# EasyEDA schematic 1-Schematic_BLE_WAVER_DONGLE.json
TITLE: Sheet_1; REV: 1.0; Date: 2022-12-25; Sheet: 1/1; Drawn By: maarnotto; Company: Your Company
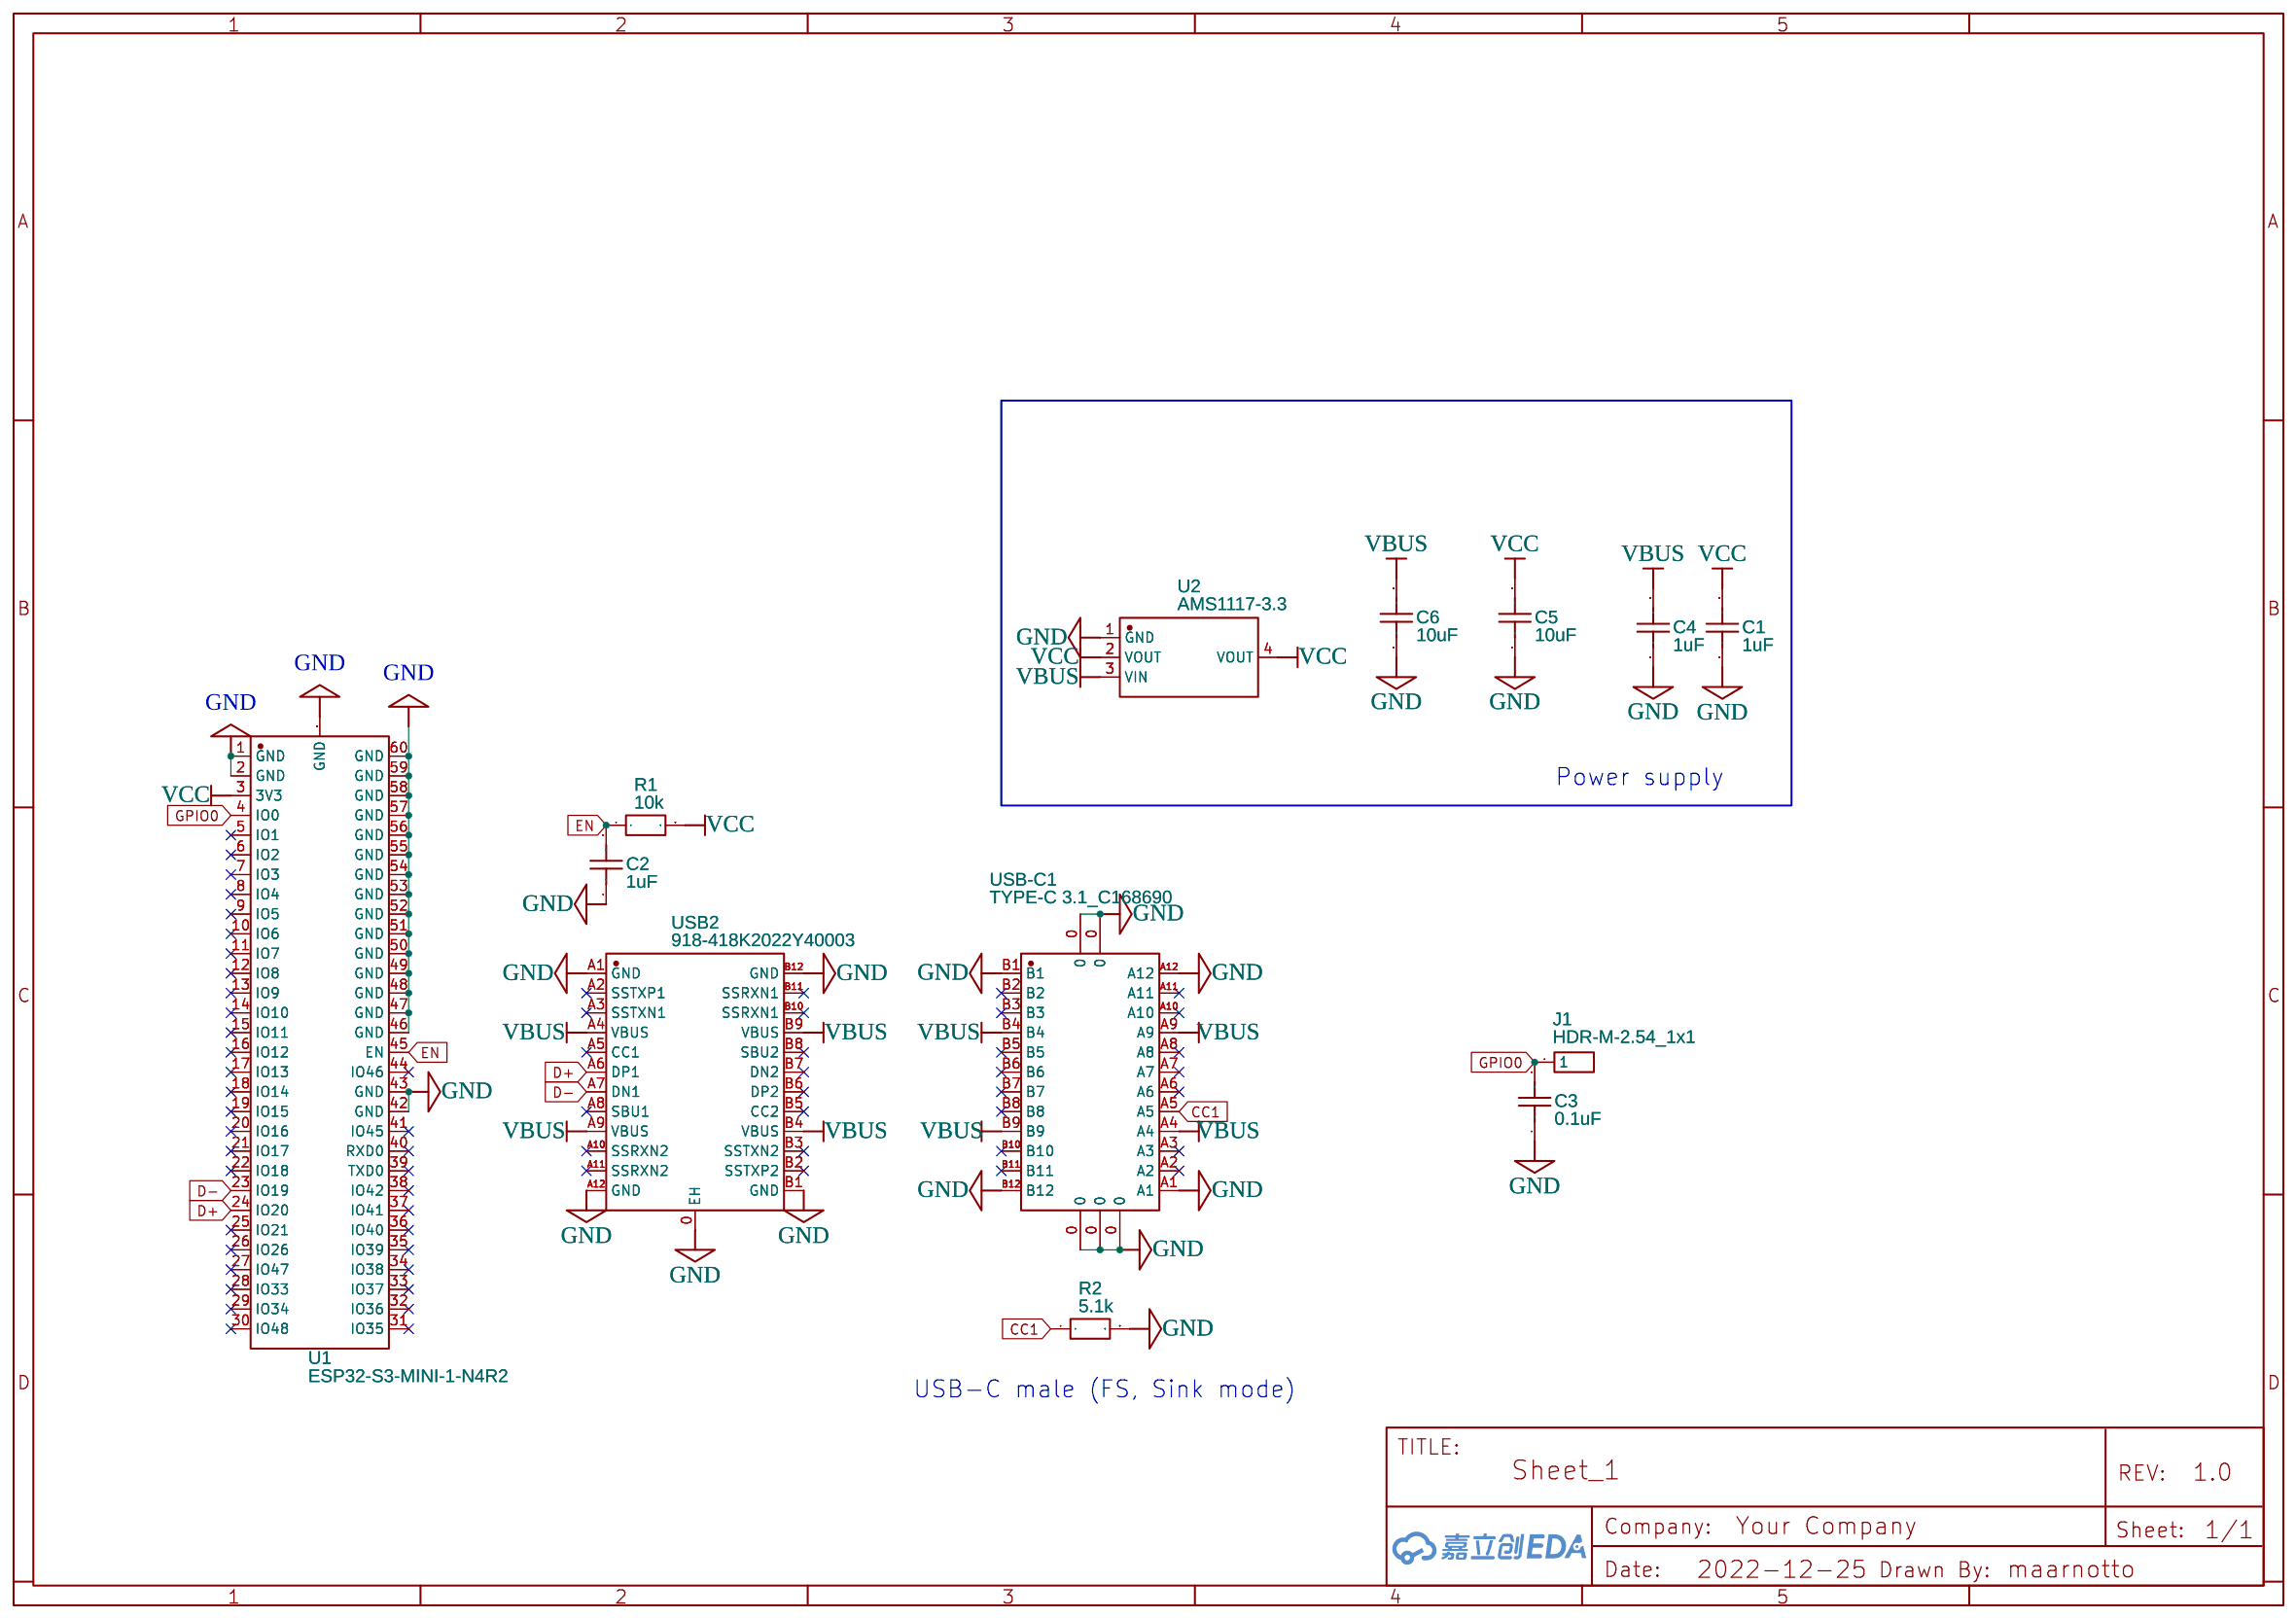
[diagram p0: schematic sheet]

## Parts
C1  1uF  [C0603]
C2  1uF  [C0603]
C3  0.1uF  [C0603]
C4  1uF  [C0603]
C5  10uF  [C0603]
C6  10uF  [C0603]
J1  HDR-M-2.54_1x1  [HDR-M-2.54_1X1]
R1  10k  [R0603]
R2  5.1k  [R0603]
U1  ESP32-S3-MINI-1-N4R2  [BULETM-SMD_ESP32-S3-MINI-1-N8]
U2  AMS1117-3.3  [SOT-223-3_L6.5-W3.4-P2.30-LS7.0-BR]
USB2  918-418K2022Y40003  [TYPE-C-SMD_918-418K2022Y40003]
USB-C1  TYPE-C 3.1_C168690  [USB-C-SMD_TYPE-C-USB-3]

## Library data of the parts
C1-C6 = C_0603_US: Contributor: LCEDA_Lib
J1 = HDR-M-2.54_1x1: Supplier Part: C81276; Supplier: LCSC; Contributor: LCEDA_Lib
R1 R2 = R_0603_EU: Contributor: LCEDA_Lib
U1 = ESP32-S3-MINI-1-N4R2: Supplier: LCSC; Supplier Part: C3013941; Manufacturer: ESPRESSIF(乐鑫); Contributor: lcsc; JLCPCB Part Class: Extended Part
U2 = AMS1117-3.3: sourceId: dwIGgezVh; Supplier: LCSC; Manufacturer: AMS; Supplier Part: C6186; JLCPCB Part Class: Basic Part
USB2 = 918-418K2022Y40003: Contributor: LCSC; Supplier: LCSC; Supplier Part: C67382; Manufacturer: 精拓金; JLCPCB Part Class: Extended Part
USB-C1 = TYPE-C 3.1_C168690: Contributor: 立创EDA官方封装库; Supplier: LCSC; Supplier Part: C168690; Manufacturer: 精拓金; Manufacturer Part: 918-118A2021Y40000; JLCPCB Part Class: Extended Part

## Nets
GND: C1.1 C2.1 C3.1 C4.1 C5.1 C6.1 R2.2 U1.1(GND) U1.2(GND) U1.42(GND) U1.43(GND) U1.46(GND) U1.47(GND) U1.48(GND) U1.49(GND) U1.50(GND) U1.51(GND) U1.52(GND) U1.53(GND) U1.54(GND) U1.55(GND) U1.56(GND) U1.57(GND) U1.58(GND) U1.59(GND) U1.60(GND) U1.GND U2.1(GND) USB2.0(EH) USB2.A1(GND) USB2.A12(GND) USB2.B1(GND) USB2.B12(GND) USB-C1.0 USB-C1.A1 USB-C1.A12 USB-C1.B1 USB-C1.B12
VBUS: C4.2 C6.2 U2.3(VIN) USB2.A4(VBUS) USB2.A9(VBUS) USB2.B4(VBUS) USB2.B9(VBUS) USB-C1.A4 USB-C1.A9 USB-C1.B4 USB-C1.B9
VCC: C1.2 C5.2 R1.2 U1.3(3V3) U2.2(VOUT) U2.4(VOUT)
CC1: R2.1 USB-C1.A5
D+: U1.24(IO20) USB2.A6(DP1)
D-: U1.23(IO19) USB2.A7(DN1)
EN: C2.2 R1.1 U1.45(EN)
GPIO0: C3.2 J1.1 U1.4(IO0)

Not connected (* = marked no-connect by the designer): U1 5(IO1)* 6(IO2)* 7(IO3)* 8(IO4)* 9(IO5)* 10(IO6)* 11(IO7)* 12(IO8)* 13(IO9)* 14(IO10)* 15(IO11)* 16(IO12)* 17(IO13)* 18(IO14)* 19(IO15)* 20(IO16)* 21(IO17)* 22(IO18)* 25(IO21)* 26(IO26)* 27(IO47)* 28(IO33)* 29(IO34)* 30(IO48)* 31(IO35)* 32(IO36)* 33(IO37)* 34(IO38)* 35(IO39)* 36(IO40)* 37(IO41)* 38(IO42)* 39(TXD0)* 40(RXD0)* 41(IO45)* 44(IO46)*; USB2 A2(SSTXP1)* A3(SSTXN1)* A5(CC1)* A8(SBU1)* A10(SSRXN2)* A11(SSRXN2)* B2(SSTXP2)* B3(SSTXN2)* B5(CC2)* B6(DP2)* B7(DN2)* B8(SBU2)* B10(SSRXN1)* B11(SSRXN1)*; USB-C1 A2* A3* A6* A7* A8* A10* A11* B2* B3* B5* B6* B7* B8* B10* B11*

## Notes on the sheet
- Power supply
- USB-C male (FS, Sink mode)
